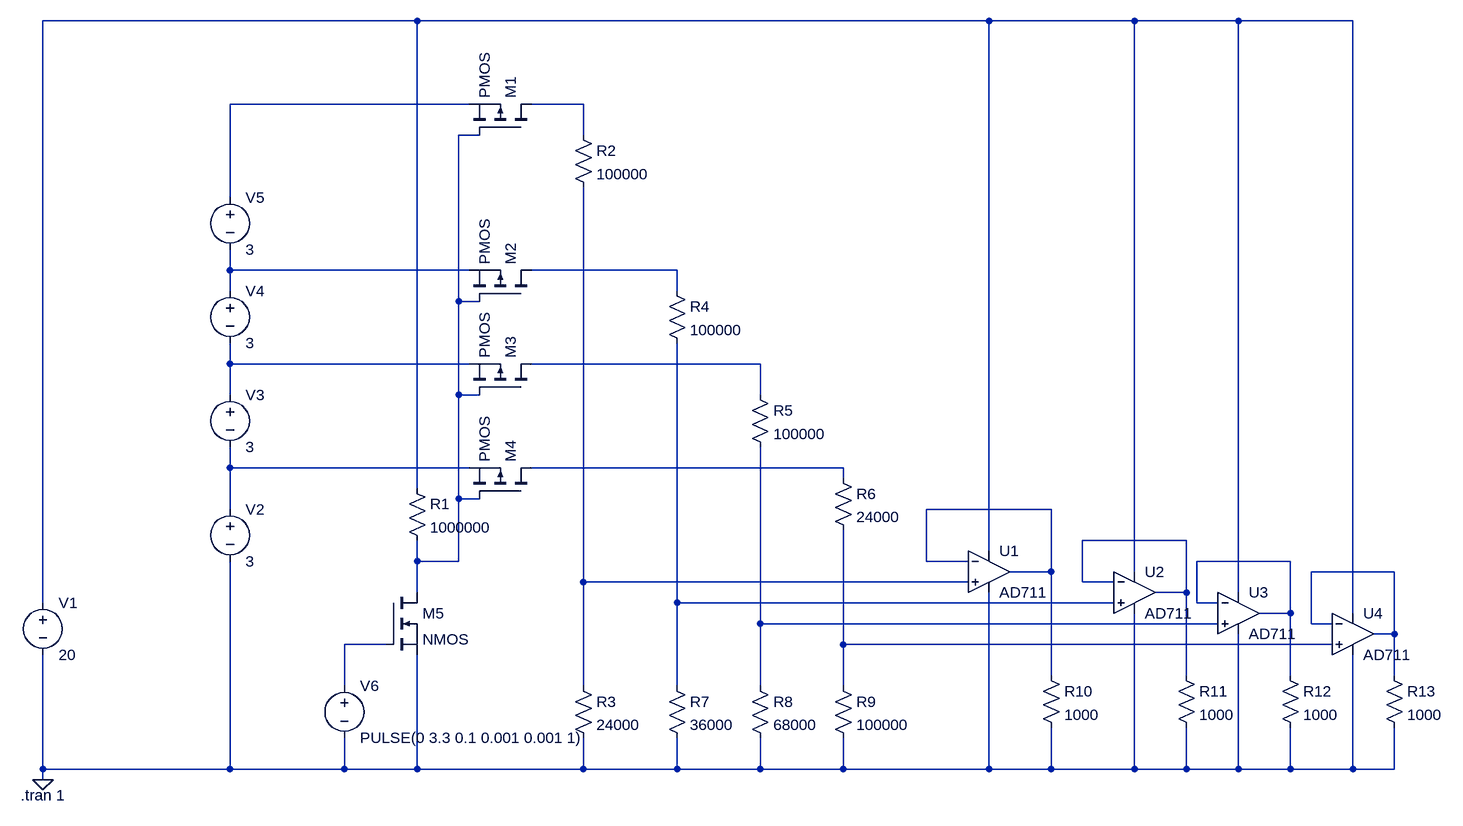
[diagram p0: schematic cell_measurement.asc]
cell_measurement.asc, the LTspice schematic file:
Version 4
SHEET 1 2724 680
WIRE 624 -944 48 -944
WIRE 1504 -944 624 -944
WIRE 1728 -944 1504 -944
WIRE 1888 -944 1728 -944
WIRE 2064 -944 1888 -944
WIRE 704 -816 336 -816
WIRE 880 -816 800 -816
WIRE 720 -768 688 -768
WIRE 880 -768 880 -816
WIRE 336 -672 336 -816
WIRE 336 -560 336 -592
WIRE 704 -560 336 -560
WIRE 1024 -560 800 -560
WIRE 336 -528 336 -560
WIRE 1024 -528 1024 -560
WIRE 688 -512 688 -768
WIRE 720 -512 688 -512
WIRE 336 -416 336 -448
WIRE 704 -416 336 -416
WIRE 1152 -416 800 -416
WIRE 336 -368 336 -416
WIRE 688 -368 688 -512
WIRE 720 -368 688 -368
WIRE 1152 -368 1152 -416
WIRE 336 -256 336 -288
WIRE 704 -256 336 -256
WIRE 1280 -256 800 -256
WIRE 1280 -240 1280 -256
WIRE 624 -224 624 -944
WIRE 688 -208 688 -368
WIRE 720 -208 688 -208
WIRE 336 -192 336 -256
WIRE 1600 -192 1408 -192
WIRE 1808 -144 1648 -144
WIRE 1504 -128 1504 -944
WIRE 624 -112 624 -144
WIRE 688 -112 688 -208
WIRE 688 -112 624 -112
WIRE 1408 -112 1408 -192
WIRE 1472 -112 1408 -112
WIRE 1968 -112 1824 -112
WIRE 1600 -96 1600 -192
WIRE 1600 -96 1536 -96
WIRE 1728 -96 1728 -944
WIRE 2128 -96 2000 -96
WIRE 880 -80 880 -688
WIRE 1472 -80 880 -80
WIRE 1648 -80 1648 -144
WIRE 1696 -80 1648 -80
WIRE 624 -64 624 -112
WIRE 1808 -64 1808 -144
WIRE 1808 -64 1760 -64
WIRE 1888 -64 1888 -944
WIRE 48 -48 48 -944
WIRE 1024 -48 1024 -448
WIRE 1696 -48 1024 -48
WIRE 1824 -48 1824 -112
WIRE 1856 -48 1824 -48
WIRE 1968 -32 1968 -112
WIRE 1968 -32 1920 -32
WIRE 2064 -32 2064 -944
WIRE 1152 -16 1152 -288
WIRE 1856 -16 1152 -16
WIRE 2000 -16 2000 -96
WIRE 2032 -16 2000 -16
WIRE 2128 0 2128 -96
WIRE 2128 0 2096 0
WIRE 576 16 512 16
WIRE 1280 16 1280 -160
WIRE 2032 16 1280 16
WIRE 1600 64 1600 -96
WIRE 1808 64 1808 -64
WIRE 1968 64 1968 -32
WIRE 2128 64 2128 0
WIRE 512 80 512 16
WIRE 880 80 880 -80
WIRE 1024 80 1024 -48
WIRE 1152 80 1152 -16
WIRE 1280 80 1280 16
WIRE 48 208 48 32
WIRE 336 208 336 -112
WIRE 336 208 48 208
WIRE 512 208 512 160
WIRE 512 208 336 208
WIRE 624 208 624 32
WIRE 624 208 512 208
WIRE 880 208 880 160
WIRE 880 208 624 208
WIRE 1024 208 1024 160
WIRE 1024 208 880 208
WIRE 1152 208 1152 160
WIRE 1152 208 1024 208
WIRE 1280 208 1280 160
WIRE 1280 208 1152 208
WIRE 1504 208 1504 -64
WIRE 1504 208 1280 208
WIRE 1600 208 1600 144
WIRE 1600 208 1504 208
WIRE 1728 208 1728 -32
WIRE 1728 208 1600 208
WIRE 1808 208 1808 144
WIRE 1808 208 1728 208
WIRE 1888 208 1888 0
WIRE 1888 208 1808 208
WIRE 1968 208 1968 144
WIRE 1968 208 1888 208
WIRE 2064 208 2064 32
WIRE 2064 208 1968 208
WIRE 2128 208 2128 144
WIRE 2128 208 2064 208
WIRE 48 224 48 208
FLAG 48 224 0
SYMBOL voltage 48 -64 R0
WINDOW 123 0 0 Left 0
WINDOW 39 0 0 Left 0
SYMATTR InstName V1
SYMATTR Value 20
SYMBOL voltage 336 -208 R0
WINDOW 123 0 0 Left 0
WINDOW 39 0 0 Left 0
SYMATTR InstName V2
SYMATTR Value 3
SYMBOL voltage 336 -384 R0
WINDOW 123 0 0 Left 0
WINDOW 39 0 0 Left 0
SYMATTR InstName V3
SYMATTR Value 3
SYMBOL voltage 336 -544 R0
WINDOW 123 0 0 Left 0
WINDOW 39 0 0 Left 0
SYMATTR InstName V4
SYMATTR Value 3
SYMBOL voltage 336 -688 R0
WINDOW 123 0 0 Left 0
WINDOW 39 0 0 Left 0
SYMATTR InstName V5
SYMATTR Value 3
SYMBOL pmos 800 -768 M270
SYMATTR InstName M1
SYMBOL pmos 800 -512 M270
SYMATTR InstName M2
SYMBOL pmos 800 -368 M270
SYMATTR InstName M3
SYMBOL pmos 800 -208 M270
SYMATTR InstName M4
SYMBOL nmos 576 -64 R0
SYMATTR InstName M5
SYMBOL res 608 -240 R0
SYMATTR InstName R1
SYMATTR Value 1000000
SYMBOL voltage 512 64 R0
WINDOW 123 0 0 Left 0
WINDOW 39 0 0 Left 0
SYMATTR InstName V6
SYMATTR Value PULSE(0 3.3 0.1 0.001 0.001 1)
SYMBOL OpAmps\\AD711 1504 -160 R0
SYMATTR InstName U1
SYMBOL res 864 -784 R0
SYMATTR InstName R2
SYMATTR Value 100000
SYMBOL res 864 64 R0
SYMATTR InstName R3
SYMATTR Value 24000
SYMBOL res 1008 -544 R0
SYMATTR InstName R4
SYMATTR Value 100000
SYMBOL res 1136 -384 R0
SYMATTR InstName R5
SYMATTR Value 100000
SYMBOL res 1264 -256 R0
SYMATTR InstName R6
SYMATTR Value 24000
SYMBOL res 1008 64 R0
SYMATTR InstName R7
SYMATTR Value 36000
SYMBOL res 1136 64 R0
SYMATTR InstName R8
SYMATTR Value 68000
SYMBOL res 1264 64 R0
SYMATTR InstName R9
SYMATTR Value 100000
SYMBOL OpAmps\\AD711 1728 -128 R0
SYMATTR InstName U2
SYMBOL OpAmps\\AD711 1888 -96 R0
SYMATTR InstName U3
SYMBOL OpAmps\\AD711 2064 -64 R0
SYMATTR InstName U4
SYMBOL res 1584 48 R0
SYMATTR InstName R10
SYMATTR Value 1000
SYMBOL res 1792 48 R0
SYMATTR InstName R11
SYMATTR Value 1000
SYMBOL res 1952 48 R0
SYMATTR InstName R12
SYMATTR Value 1000
SYMBOL res 2112 48 R0
SYMATTR InstName R13
SYMATTR Value 1000
TEXT 14 248 Left 2 !.tran 1

The netlist it stands for:
* cell_measurement.asc
V1 N001 0 20
V2 N009 0 3
V3 N007 N009 3
V4 N005 N007 3
V5 N002 N005 3
M1 N003 N004 N002 N002 PMOS
M2 N006 N004 N005 N005 PMOS
M3 N008 N004 N007 N007 PMOS
M4 N010 N004 N009 N009 PMOS
M5 N004 N018 0 0 NMOS
R1 N001 N004 1000000
V6 N018 0 PULSE(0 3.3 0.1 0.001 0.001 1)
XU1 N015 N011 N001 0 N011 AD712  ; AD711, pins In+ In- V+ V- OUT
R2 N003 N015 100000
R3 N015 0 24000
R4 N006 N016 100000
R5 N008 N017 100000
R6 N010 N019 24000
R7 N016 0 36000
R8 N017 0 68000
R9 N019 0 100000
XU2 N016 N012 N001 0 N012 AD712  ; AD711, pins In+ In- V+ V- OUT
XU3 N017 N013 N001 0 N013 AD712  ; AD711, pins In+ In- V+ V- OUT
XU4 N019 N014 N001 0 N014 AD712  ; AD711, pins In+ In- V+ V- OUT
R10 N011 0 1000
R11 N012 0 1000
R12 N013 0 1000
R13 N014 0 1000
.model NMOS NMOS
.model PMOS PMOS
.lib standard.mos
.tran 1
.lib ADI1.lib
.backanno
.end